# EasyEDA Pro project StepperDriver_v1_0_2025-04-13_12-39-48.eprj

# Schematic Schematic1
Board Name: Board1; Create Date: 2025-04-13; Page Name: P1; Project Name: StepperDriver_v1_0_2025-04-13_12-39-48; Schematic Name: Schematic1; Update Date: 2025-04-13; Company: 嘉立创EDA; Drawed: 王大智; Page Size: A4; Version: V1.0
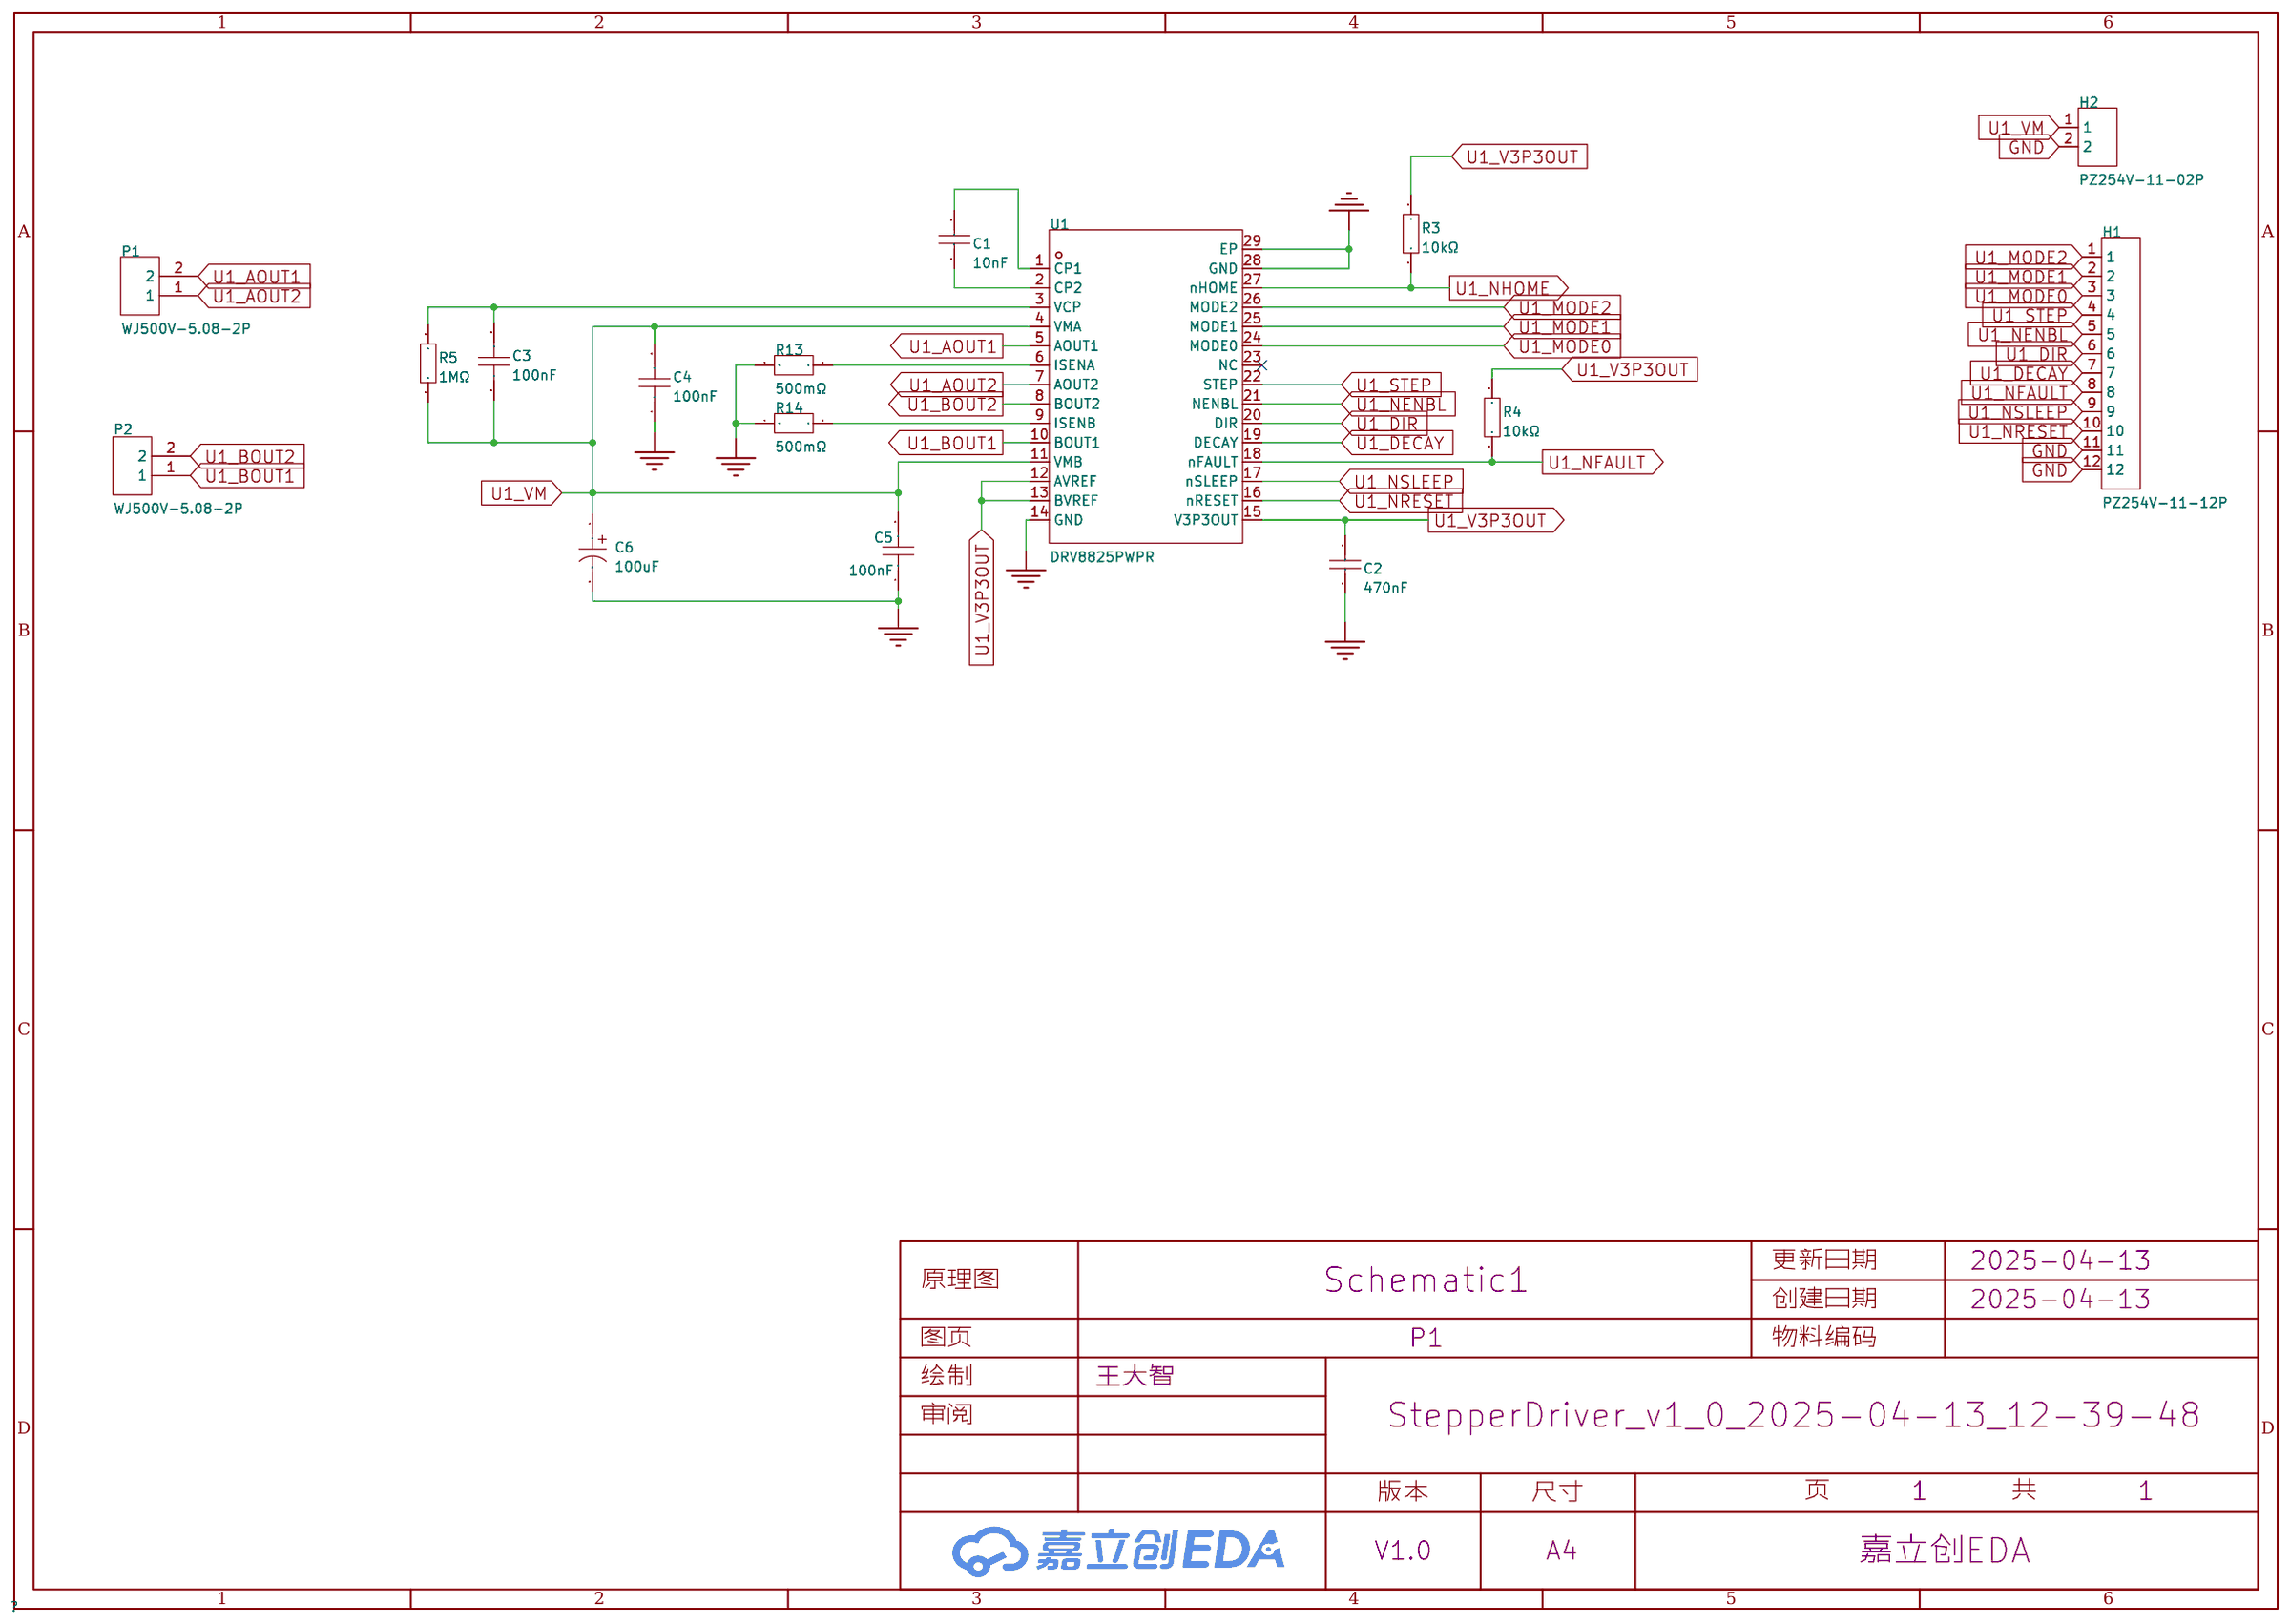
[diagram p0: schematic sheet]

## Parts
C1  10nF  [C0603]
C2  470nF  [C0603]
C3  100nF  [C0603]
C4  100nF  [C0603]
C5  100nF  [C0603]
C6  100uF  [CAP-SMD_BD8.1-L8.3-W8.3-LS9.3-FD]
H1  PZ254V-11-12P  [HDR-TH_12P-P2.54-V-M]
H2  PZ254V-11-02P  [HDR-TH_2P-P2.54-V-M]
P1  WJ500V-5.08-2P  [CONN-TH_2P-P5.00_WJ500V-5.08-2P]
P2  WJ500V-5.08-2P  [CONN-TH_2P-P5.00_WJ500V-5.08-2P]
R3  10kΩ  [R0603]
R4  10kΩ  [R0603]
R5  1MΩ  [R0603]
R13  500mΩ  [R0603]
R14  500mΩ  [R0603]
U1  DRV8825PWPR  [HTSSOP-28_L9.7-W4.4-P0.65-LS6.4-BL-EP]

## Library data of the parts
C1 = CL10B103KB8NNNC: LCSC Part Name: 10nF ±10% 50V; Supplier Part: C1589; Manufacturer: SAMSUNG(三星); Supplier Footprint: 0603; JLCPCB Part Class: 扩展库; Datasheet: https://atta.szlcsc.com/upload/public/pdf/source/20160218/1457707763339.pdf; Supplier: LCSC; Tolerance: ±10%; Voltage Rated: 50V; Temperature Coefficient: X7R
C2 = CL10B474KA8NNNC: LCSC Part Name: 470nF ±10% 25V; Supplier Part: C1623; Manufacturer: SAMSUNG(三星); Supplier Footprint: 0603; JLCPCB Part Class: 基础库; Datasheet: https://atta.szlcsc.com/upload/public/pdf/source/20160218/1457707763339.pdf; Supplier: LCSC; Tolerance: ±10%; Voltage Rated: 25V; Temperature Coefficient: X7R
C3-C5 = CGA0603X7R104K500JT: LCSC Part Name: 100nF ±10% 50V; Supplier Part: C6119867; Manufacturer: HRE(芯声); Supplier Footprint: 0603; JLCPCB Part Class: 扩展库; Datasheet: https://atta.szlcsc.com/upload/public/pdf/source/20250103/C44077DA9E7B3EFAE02F22B6D3D1CBC9.pdf; Supplier: LCSC; Tolerance: ±10%; Voltage Rating: 50V; Temperature Coefficient: X7R
C6 = GVE1H107M0810CNVC: LCSC Part Name: 100uF ±20% 50V; Supplier Part: C2983307; Manufacturer: HRK(鸿瑞凯电子); Supplier Footprint: SMD,D8xL10.5mm; JLCPCB Part Class: 扩展库; Datasheet: https://atta.szlcsc.com/upload/public/pdf/source/20220321/B5A059027F69866A3EEEBC781A889613.pdf; Supplier: LCSC; Tolerance: ±20%; Rated Voltage: 50V; Ripple Current: 300mA@100kHz; Equivalent Series Resistance(ESR): 600mΩ@100kHz; φD: 8mm; L: 10.5mm; Lifetime @ Temp: 2000hrs@105℃; Operating Temperature: -55℃~+105℃
H1 = PZ254V-11-12P: LCSC Part Name: 1x12P 间距:2.54mm 方针 直插; Supplier Part: C2840012; Manufacturer: XFCN(兴飞); Supplier Footprint: 插件,P=2.54mm; JLCPCB Part Class: 扩展库; Datasheet: https://atta.szlcsc.com/upload/public/pdf/source/20200309/C492403_F9F19131791D08044AD4F84F8E751A34.pdf; Supplier: LCSC; Pin Structure: 1x12P; Pitch: 2.54mm; Circluar Pins/Square Pins: 方针; Mounting Type: 直插; Number of Rows: 单排; Number of Pins: 12P; Current Rating: 3A; Voltage Rating (Max): 250V; Length of Mating Pin: 6mm; Insulation Height: 2.5mm; Length of End Connection Pin: 3mm; Operating Temperature: -40℃~+105℃; Color: 黑色
H2 = PZ254V-11-02P: LCSC Part Name: 1x2P 间距:2.54mm 方针 直插; Supplier Part: C492401; Manufacturer: XFCN(兴飞); Supplier Footprint: 插件,P=2.54mm; JLCPCB Part Class: 扩展库; Datasheet: https://atta.szlcsc.com/upload/public/pdf/source/20200309/C492401_A812433581A9B211A7FFA413ADDFF0E5.pdf; Supplier: LCSC; Pin Structure: 1x2P; Pitch: 2.54mm; Circluar Pins/Square Pins: 方针; Mounting Type: 直插; Number of Rows: 单排; Number of Pins: 2P; Length of Mating Pin: 6mm; Insulation Height: 2.5mm; Length of End Connection Pin: 3mm; Contact Material: 黄铜; Operating Temperature: -40℃~+105℃; Color: 黑色
P1 P2 = WJ500V-5.08-2P: LCSC Part Name: 1x2P 5.08mm 直插 排数:1 每排P数:2; Supplier Part: C8465; Manufacturer: KANGNEX(康奈克斯电气); Supplier Footprint: 插件,P=5.08mm; JLCPCB Part Class: 扩展库; Datasheet: https://atta.szlcsc.com/upload/public/pdf/source/20191225/C8465_02D34CE5B5B4A53DF5891601D97FA9F4.pdf; Supplier: LCSC; Structure: 1x2P; Pitch: 5.08mm; Color: 绿色; Mounting Style: 直插; Current Rating (Max): 18A; Voltage Rating (Max): 250V; Number of Pins: 2P; Number of Rows: 1; Wire Gauge - AWG: 14~30; Wire Gauge - mm2: 2.5; Number of PINs Per Row: 2; Operating Temperature Range: -40℃~+105℃; Screw Specification: M2.5
R3 R4 = RC0603FR-0710KL: LCSC Part Name: 厚膜电阻 10kΩ ±1% 100mW; Supplier Part: C98220; Manufacturer: YAGEO(国巨); Supplier Footprint: 0603; JLCPCB Part Class: 扩展库; Datasheet: https://atta.szlcsc.com/upload/public/pdf/source/20180927/C295883_E8D83085EA81BD7DE0B2B681138C15EE.pdf; Supplier: LCSC; Type: 厚膜电阻; Tolerance: ±1%; Power(Watts): 100mW; Overload Voltage (Max): 75V; Temperature Coefficient: ±100ppm/℃; Operating Temperature Range: -55℃~+155℃
R5 = 0603WAF1004T5E: LCSC Part Name: 1MΩ ±1% 100mW 厚膜电阻; Supplier Part: C22935; Manufacturer: UNI-ROYAL(厚声); Supplier Footprint: 0603; JLCPCB Part Class: Basic Part; Datasheet: https://atta.szlcsc.com/upload/public/pdf/source/20200306/C422600_1E6D84923E4A46A82E41ADD87F860B5C.pdf; Supplier: LCSC; Type: 厚膜电阻; Tolerance: ±1%; Power(Watts): 100mW; Overload Voltage (Max): 75V; Temperature Coefficient: ±100ppm/℃; Operating Temperature Range: -55℃~+155℃
R13 R14 = FRL0603JR500TS: LCSC Part Name: 500mΩ ±5% 100mW 厚膜电阻; Supplier Part: C2930046; Manufacturer: FOJAN(富捷); Supplier Footprint: 0603; JLCPCB Part Class: 扩展库; Datasheet: https://atta.szlcsc.com/upload/public/pdf/source/20211221/925EC7D7225764EE0046F22065062C87.pdf; Supplier: LCSC; Type: 厚膜电阻; Tolerance: ±5%; Power(Watts): 100mW; Overload Voltage (Max): 100V; Temperature Coefficient: ±300ppm/℃; Operating Temperature Range: -55℃~+155℃
U1 = DRV8825PWPR: LCSC Part Name: 2.5A 45V电机驱动芯片; Supplier Part: C81582; Manufacturer: TI(德州仪器); Supplier Footprint: HTSSOP-28-EP; JLCPCB Part Class: 扩展库; Datasheet: https://www.ti.com/cn/lit/gpn/drv8825; Supplier: LCSC

## Nets
GND: C2.1 C4.1 C5.1 C6.2 H1.11 H1.12 H2.2 R13.1 R14.1 U1.14(GND) U1.28(GND) U1.29(EP)
U1_AOUT1: P1.2 U1.5(AOUT1)
U1_AOUT2: P1.1 U1.7(AOUT2)
U1_BOUT1: P2.1 U1.10(BOUT1)
U1_BOUT2: P2.2 U1.8(BOUT2)
U1_DECAY: H1.7 U1.19(DECAY)
U1_DIR: H1.6 U1.20(DIR)
U1_MODE0: H1.3 U1.24(MODE0)
U1_MODE1: H1.2 U1.25(MODE1)
U1_MODE2: H1.1 U1.26(MODE2)
U1_NENBL: H1.5 U1.21(NENBL)
U1_NFAULT: H1.8 R4.1 U1.18(nFAULT)
U1_NHOME: R3.1 U1.27(nHOME)
U1_NRESET: H1.10 U1.16(nRESET)
U1_NSLEEP: H1.9 U1.17(nSLEEP)
U1_STEP: H1.4 U1.22(STEP)
U1_V3P3OUT: C2.2 R3.2 R4.2 U1.12(AVREF) U1.13(BVREF) U1.15(V3P3OUT)
U1_VM: C3.1 C4.2 C5.2 C6.1 H2.1 R5.1 U1.4(VMA) U1.11(VMB)
$1N331: C1.1 U1.2(CP2)
$1N336: C1.2 U1.1(CP1)
$1N509: R13.2 U1.6(ISENA)
$1N513: R14.2 U1.9(ISENB)
$1N1403: C3.2 R5.2 U1.3(VCP)

Not connected (* = marked no-connect by the designer): U1 23(NC)*

# Board PCB1
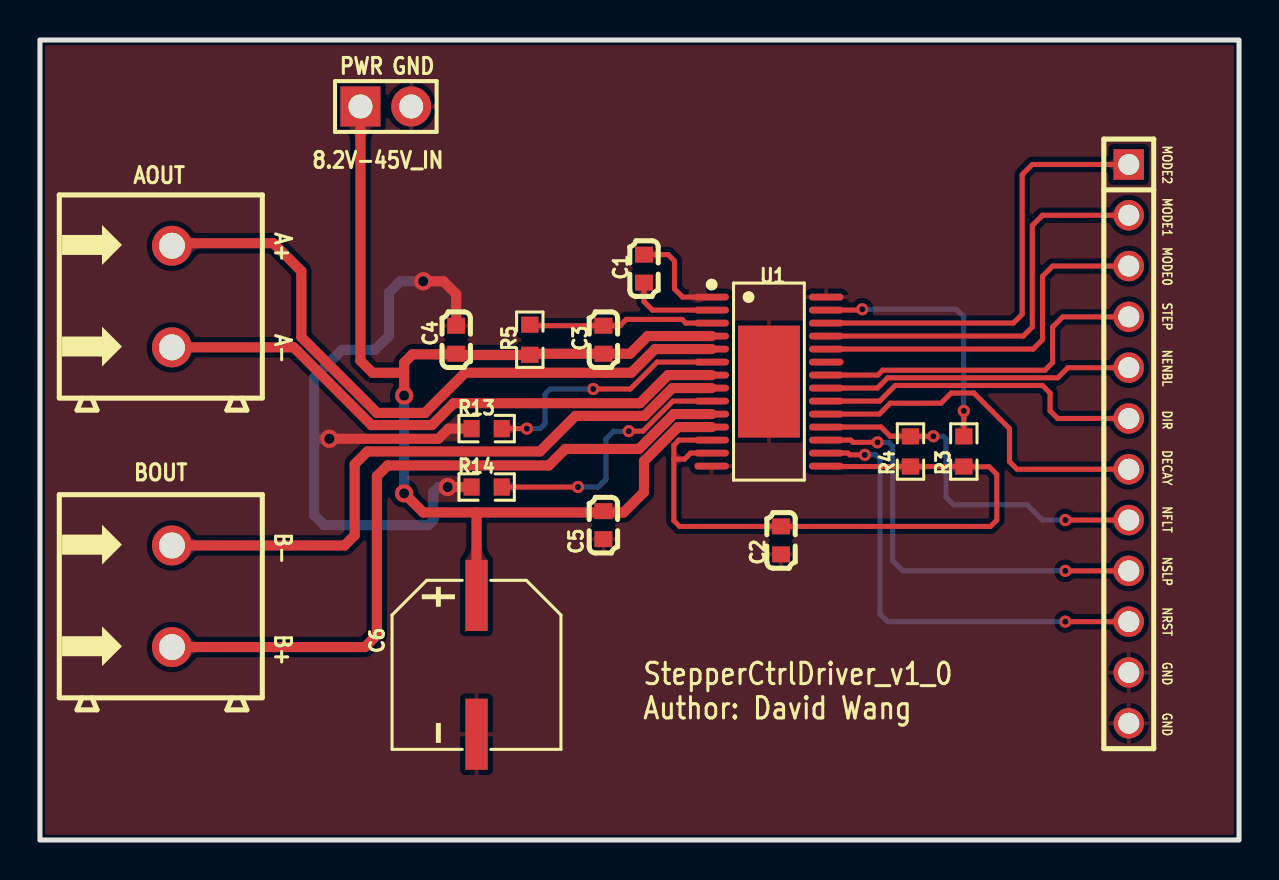
[diagram p1: board, top side]
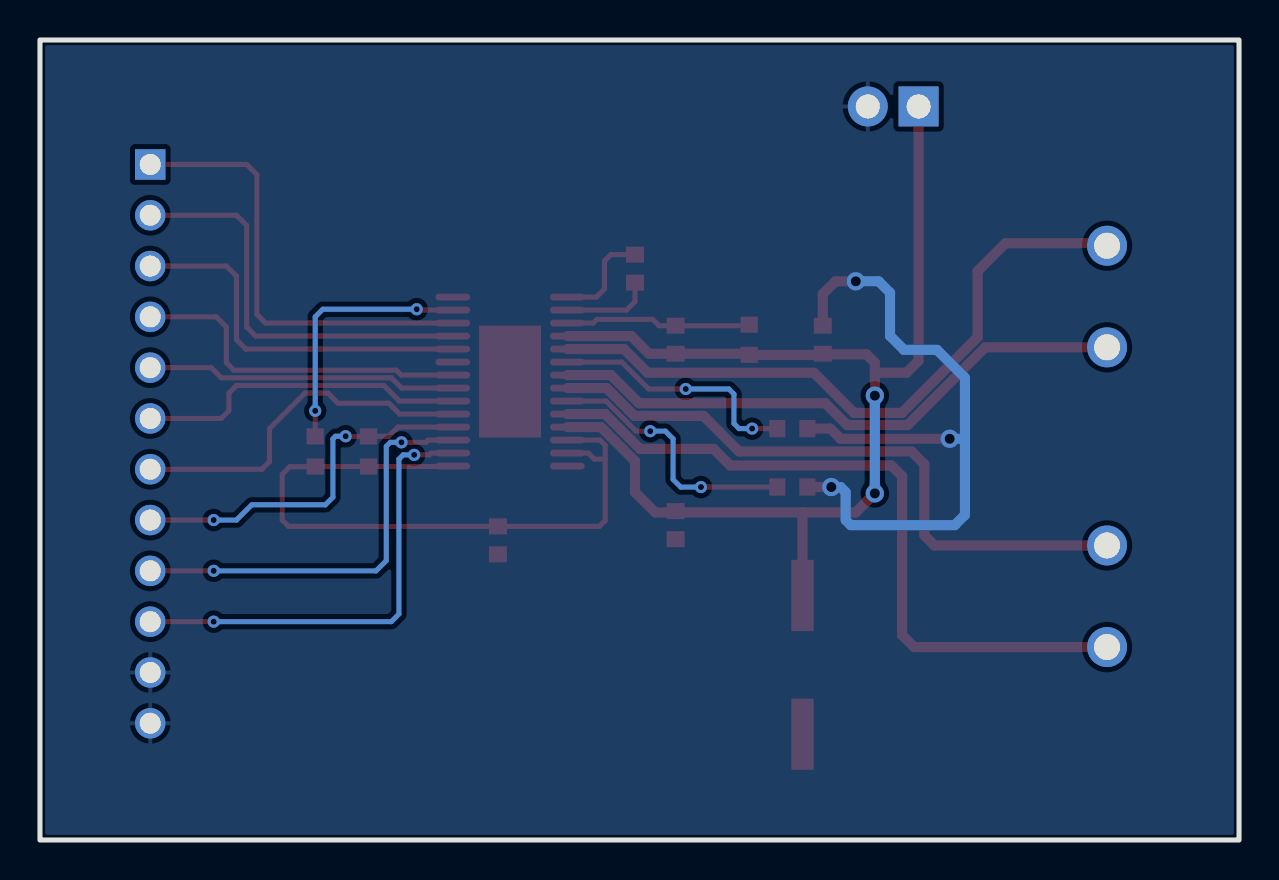
[diagram p2: board, bottom side, seen from below]

Outline 60 x 40 mm; copper layers: Top Layer, Bottom Layer. Coordinates in mm from the lower left corner of the outline.
Outline path: rectangle 0,40 60,0
Stack: Top Layer 0.035mm / Dielectric1 1.51mm FR4 er 4.5 / Bottom Layer 0.035mm

## Design rules (mm)
template: JLCPCB Capability(Two Layers Board)
spacing copperThickness1oz (default): track to track 0.102, other pairs 0.152 to 0.3
spacing copperThickness2oz: track to track 0.203, other pairs 0.152 to 0.3
track width copperThickness1oz (default): min 0.127, default 0.254, max 2.54
track width copperThickness2oz: min 0.203, default 0.254, max 2.54
differential pair differentialPair (default): width min 0.127, default 0.254, max 2.54; gap min 0.152, default 0.152
via viaSize (default): diameter min 0.5, default 0.61, max 10; hole min 0.3, default 0.305, max 6.3

## Placement (name value [footprint] x y rotation side)
C1  10nF  [C0603]  30.23 28.57 90 top
C2  470nF  [C0603]  37.08 14.98 90 top
C3  100nF  [C0603]  28.19 25.01 90 top
C4  100nF  [C0603]  20.83 25.01 270 top
C5  100nF  [C0603]  28.19 15.74 90 top
C6  100uF  [CAP-SMD_BD8.1-L8.3-W8.3-LS9.3-FD]  21.84 8.76 270 top
H1  PZ254V-11-12P  [HDR-TH_12P-P2.54-V-M]  54.48 19.81 270 top
H2  PZ254V-11-02P  [HDR-TH_2P-P2.54-V-M]  17.31 36.68 0 top
P1  WJ500V-5.08-2P  [CONN-TH_2P-P5.00_WJ500V-5.08-2P]  6.6 27.17 90 top
P2  WJ500V-5.08-2P  [CONN-TH_2P-P5.00_WJ500V-5.08-2P]  6.6 12.19 90 top
R3  10kΩ  [R0603]  46.23 19.43 270 top
R4  10kΩ  [R0603]  43.56 19.43 270 top
R5  1MΩ  [R0603]  24.51 25.01 90 top
R13  500mΩ  [R0603]  22.35 20.57 0 top
R14  500mΩ  [R0603]  22.35 17.65 0 top
U1  DRV8825PWPR  [HTSSOP-28_L9.7-W4.4-P0.65-LS6.4-BL-EP]  36.48 22.92 270 top

## Footprints (pads in the part's own frame, mm; a bottom-side part is the same pattern mirrored in y, then rotated)
C0603
  rect 0.8x0.9 smd: 1(-0.7,0) 2(0.7,0)
CAP-SMD_BD8.1-L8.3-W8.3-LS9.3-FD
  rect 3.56x1.12 smd: 1(-3.47,0) 2(3.47,0)
CONN-TH_2P-P5.00_WJ500V-5.08-2P
  round 2 hole 1.3: 1(-2.54,0) 2(2.54,0)
HDR-TH_2P-P2.54-V-M
  rect 2x2 hole 1.2: 1(-1.27,0)
  round 2 hole 1.2: 2(1.27,0)
HDR-TH_12P-P2.54-V-M
  rect 1.524x1.524 hole 1.05: 1(-13.97,0)
  round 1.524 hole 1.05: 2(-11.43,0) 3(-8.89,0) 4(-6.35,0) 5(-3.81,0) 6(-1.27,0) 7(1.27,0) 8(3.81,0) 9(6.35,0) 10(8.89,0) 11(11.43,0) 12(13.97,0)
HTSSOP-28_L9.7-W4.4-P0.65-LS6.4-BL-EP
  oval 0.343x1.732 smd: 1(-4.225,-2.866) 2(-3.575,-2.866) 3(-2.925,-2.866) 4(-2.275,-2.866) 5(-1.625,-2.866) 6(-0.975,-2.866) 7(-0.325,-2.866) 8(0.325,-2.866) 9(0.975,-2.866) 10(1.625,-2.866) 11(2.275,-2.866) 12(2.925,-2.866) 13(3.575,-2.866) 14(4.225,-2.866) 15(4.225,2.866) 16(3.575,2.866) 17(2.925,2.866) 18(2.275,2.866) 19(1.625,2.866) 20(0.975,2.866) 21(0.325,2.866) 22(-0.325,2.866) 23(-0.975,2.866) 24(-1.625,2.866) 25(-2.275,2.866) 26(-2.925,2.866) 27(-3.575,2.866) 28(-4.225,2.866)
  rect 5.6x3.1 smd: 29(0,0)
R0603
  rect 0.806x0.864 smd: 1(-0.753,0) 2(0.753,0)

## Nets
As in the schematic.

Pads without a net: U1 23

## Via types
v1: diameter 0.914, hole 0.508, Top Layer to Bottom Layer, 5 vias
v2: diameter 0.61, hole 0.305, Top Layer to Bottom Layer, 12 vias

## Routing (per net, layer and track width the routed paths; a pad name or vN(x,y) marks a point on that pad's centre or on a via; arc(x,y) is an arc through that point)
GND: length 36.9
  Top Layer w0.508: R13.1 20.45,20.57 19.94,20.06 v1(14.48,20.06) ; C4.1 20.83,27.3 20.19,27.94 v1(19.18,27.94) ; R14.1 v1(20.4,17.65)
  Bottom Layer w0.508: v1(19.18,27.94) 18.03,27.94 17.46,27.36 17.46,25.2 16.76,24.51 15.11,24.51 13.72,23.11 13.72,20.05 ; v1(14.48,20.06) 13.73,20.06 13.72,20.05 ; 13.72,20.05 13.72,16.25 14.22,15.74 19.43,15.74 19.68,16 19.68,17.39 19.94,17.65 v1(20.4,17.65)
U1_AOUT1: length 33.8
  Top Layer w0.508: 33.61,24.55 30.77,24.55 29.59,23.36 21.27,23.36 19.27,21.36 16.86,21.36 13.08,25.14 13.08,28.44 11.68,29.84 6.73,29.84 P1.2
U1_AOUT2: length 29.7
  Top Layer w0.508: 33.61,23.25 31.43,23.25 30.02,21.84 20.7,21.84 19.61,20.75 16.59,20.75 12.7,24.63 P1.1
U1_BOUT1: length 36.5
  Top Layer w0.508: 33.61,21.3 31.71,21.3 29.97,19.55 26.29,19.55 25.46,18.73 17.4,18.73 16.86,18.19 16.86,10.25 16.26,9.65 P2.1
U1_BOUT2: length 32.4
  Top Layer w0.508: 33.61,22.6 31.64,22.6 30.25,21.2 26.8,21.2 25.02,19.43 16.38,19.43 15.75,18.79 15.75,15.23 15.24,14.73 P2.2
U1_DECAY: length 18.1
  Top Layer w0.254: H1.7 48.89,18.54 48.51,18.92 48.51,20.57 46.74,22.35 45.59,22.35 45.08,21.84 42.55,21.84 42,21.3 U1.19
U1_DIR: length 16.7
  Top Layer w0.254: H1.6 50.93,21.08 50.55,21.46 50.55,22.35 50.17,22.73 42.8,22.73 42.02,21.95 U1.20
U1_MODE0: length 18.7
  Top Layer w0.254: U1.24 49.7,24.55 50.17,25.01 50.17,28.19 50.67,28.7 H1.3
U1_MODE1: length 20.6
  Top Layer w0.254: H1.2 50.17,31.24 49.66,30.73 49.66,25.65 49.2,25.2 U1.25
U1_MODE2: length 22.5
  Top Layer w0.254: H1.1 49.66,33.78 49.15,33.27 49.15,26.28 48.71,25.85 U1.26
U1_NENBL: length 15.6
  Top Layer w0.254: U1.21 41.9,22.6 42.42,23.11 50.93,23.11 51.43,23.62 H1.5
U1_NFAULT: length 18.8
  Top Layer w0.254: 39.34,20.65 42.09,20.65 42.55,20.19 43.55,20.19 R4.1 44.7,20.18 v2(44.7,20.19) ; v2(51.31,16) H1.8
  Bottom Layer w0.254: v2(51.31,16) 50.17,16 49.4,16.76 45.72,16.76 45.34,17.14 45.34,20.06 45.21,20.19 v2(44.7,20.19)
U1_NHOME: length 13
  Top Layer w0.254: R3.1 v2(46.23,21.46) ; v2(41.15,26.54) 41.11,26.5 U1.27
  Bottom Layer w0.254: v2(41.15,26.54) 45.85,26.54 46.23,26.16 v2(46.23,21.46)
U1_NRESET: length 23.2
  Top Layer w0.254: v2(41.27,19.26) 40.52,19.26 40.43,19.35 U1.16 ; v2(51.31,10.92) H1.10
  Bottom Layer w0.254: v2(51.31,10.92) 42.42,10.92 42.04,11.3 42.04,19.05 41.83,19.26 v2(41.27,19.26)
U1_NSLEEP: length 21.2
  Top Layer w0.254: U1.17 40.58,20 40.69,19.88 v2(41.91,19.88) ; v2(51.31,13.46) H1.9
  Bottom Layer w0.254: v2(41.91,19.88) 42.47,19.88 42.67,19.68 42.67,13.96 43.18,13.46 v2(51.31,13.46)
U1_STEP: length 17.4
  Top Layer w0.254: H1.4 51.18,26.16 50.67,25.65 50.67,23.87 50.29,23.49 42.16,23.49 41.92,23.25 U1.22
U1_V3P3OUT: length 35.2
  Top Layer w0.254: 31.72,19.04 31.72,19.74 31.97,20 33.61,20 ; 31.72,19.04 31.72,15.97 32,15.68 C2.2 47.56,15.68 47.88,16 47.88,18.28 47.5,18.66 46.24,18.66 R3.2 R4.2 39.37,18.67 U1.15 ; 31.72,19.04 31.72,19.05 32.26,19.05 32.56,19.35 33.61,19.35
U1_VM: length 60.4
  Top Layer w0.508: C6.1 21.84,16.36 21.83,16.38 ; 33.61,20.65 31.93,20.65 30.23,18.94 30.23,17.39 29.21,16.38 28.26,16.38 C5.2 28.13,16.38 21.83,16.38 ; 21.83,16.38 19.18,16.38 v1(18.22,17.33) ; H2.1 16.04,23.96 16.64,23.36 18.19,23.36 18.22,23.4 ; 18.22,23.4 v1(18.22,22.22) ; 18.22,23.4 18.22,23.87 18.64,24.28 20.8,24.28 C4.2 20.89,24.25 24.5,24.25 R5.1 24.56,24.31 C3.1 29.53,24.31 30.41,25.2 33.61,25.2
  Bottom Layer w0.508: v1(18.22,17.33) v1(18.22,22.22)
$1N331: length 4.5
  Top Layer w0.254: 33.61,26.5 30.65,26.5 30.23,26.92 C1.1
$1N336: length 5.1
  Top Layer w0.254: 33.61,27.15 32.16,27.15 31.75,27.55 31.75,28.95 31.43,29.27 C1.2
$1N509: length 12.7
  Top Layer w0.254: R13.2 v2(24.36,20.57) ; v2(27.69,22.55) 29.54,22.55 30.89,23.9 33.61,23.9
  Bottom Layer w0.254: v2(27.69,22.55) 25.53,22.55 25.27,22.3 25.27,20.82 25.02,20.57 v2(24.36,20.57)
$1N513: length 13.5
  Top Layer w0.254: 33.61,21.95 31.68,21.95 30.17,20.44 v2(29.46,20.44) ; R14.2 v2(26.92,17.65)
  Bottom Layer w0.254: v2(26.92,17.65) 27.94,17.65 28.32,18.03 28.32,20.06 28.7,20.44 v2(29.46,20.44)
$1N1403: length 9.3
  Top Layer w0.254: 33.61,25.85 32.31,25.85 32.13,26.03 29.34,26.03 29.02,25.71 C3.2 24.56,25.71 R5.2

## Copper pours and planes (outline as drawn; the poured copper is in the pictures)
GND on Top Layer: -3.81,44.06 63.75,44.06 63.75,-3.18 -3.81,-3.18
GND on Bottom Layer: -8.13,49.14 68.45,49.14 68.45,-10.04 -8.13,-10.04

Small or netless copper shapes (teardrops, artwork), in the pictures only: 59 on Top Layer, 14 on Bottom Layer

## Text on the board
Top Silkscreen Layer: MODE2 | MODE1 | MODE0 | STEP | NENBL | DIR | DECAY | NFLT | NSLP | NRST | GND | AOUT | BOUT | 8.2V-45V_IN | PWR | A+ | A- | B- | B+ | StepperCtrlDriver_v1_0 / Author: David Wang
